# Altium schematic sheet PAGE05 FPGA Config.SchDoc
size 297 x 209 mm; SheetNumber: 5; SheetTotal: 9
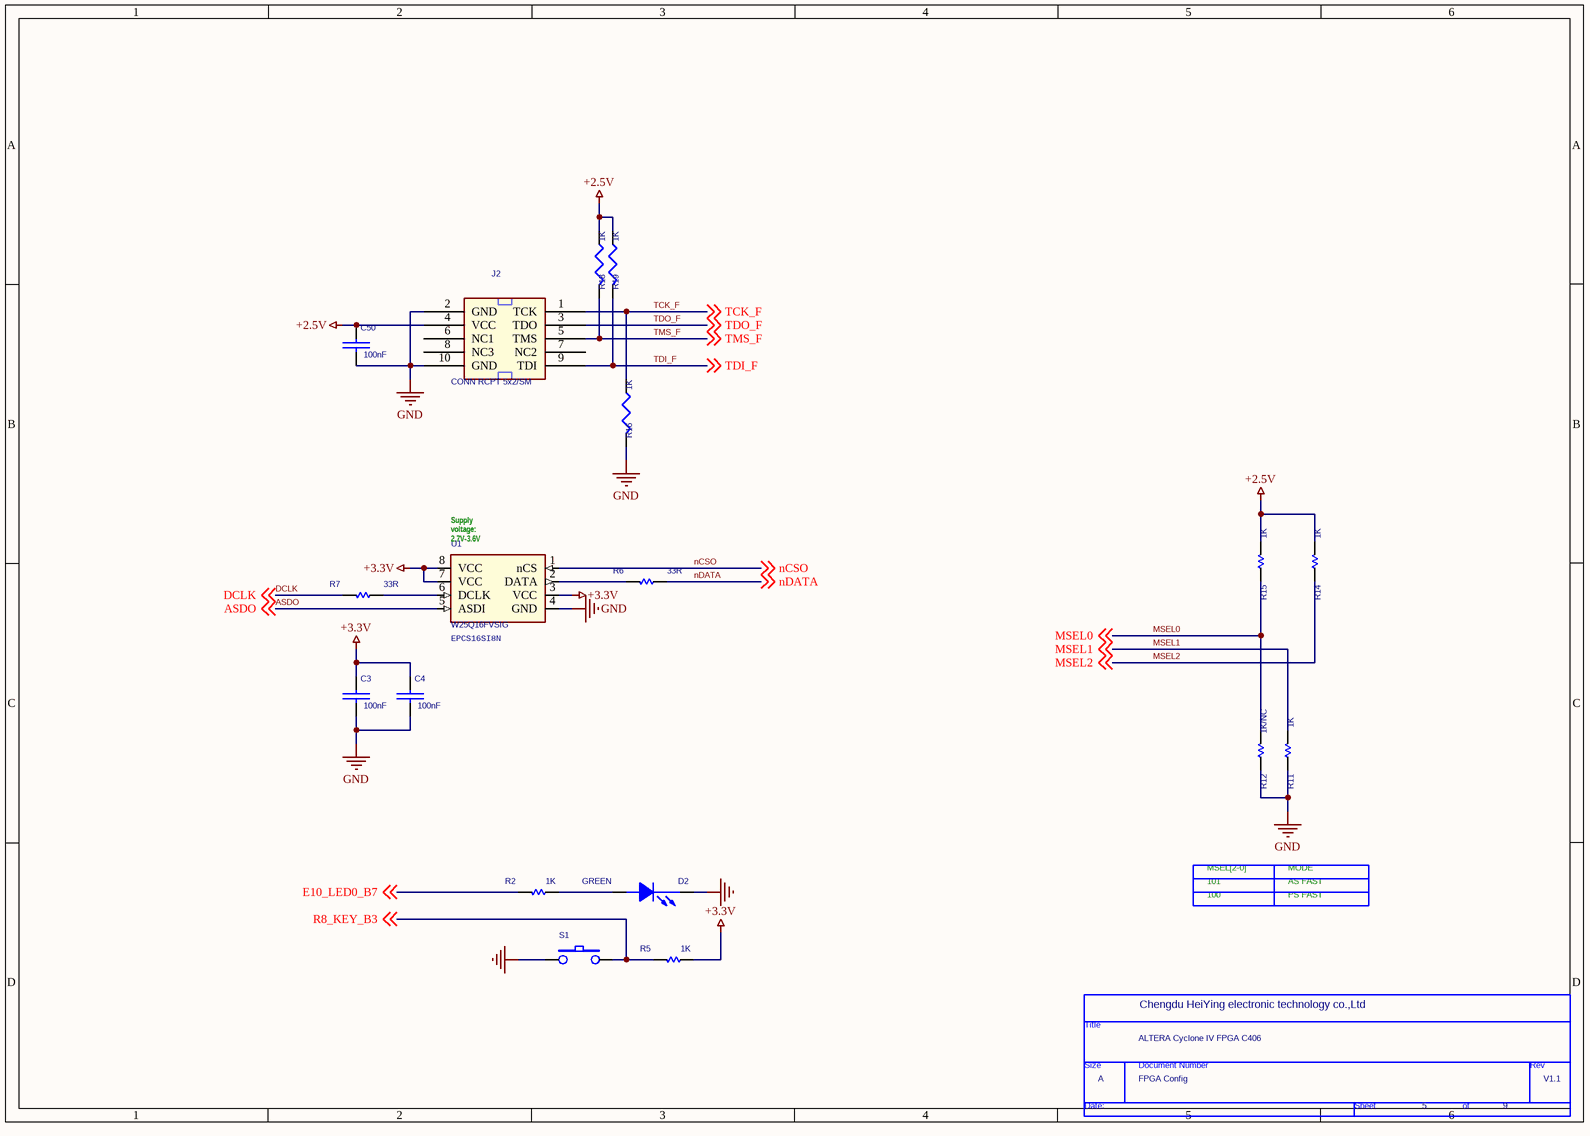
[diagram p0: PAGE05 FPGA Config.SchDoc]

## Parts
*  Page Count: 9  Page Number: 5  Page Size: A  Title: ALTERA Cyclone IV FPGA C406  RevCode: V1.1  Doc: FPGA Config  (hidden comment: TitleBlock0)  (graphical)
C3  100nF  [C0402]
C4  100nF  [C0402]
C50  100nF  [C0402]
D2  GREEN  [Q0603]
J2  CONN RCPT 5x2/SM  [DIP10-2P54-I]
R2  1K  [R0402]
R5  1K  [R0402]
R6  33R  [R0402]
R7  33R  [R0402]
R11  1K  [R0402]
R12  1K/NC  [R0402]
R14  1K  [R0402]
R15  1K  [R0402]
R16  1K  [R0402]
R18  1K  [R0402]
R19  1K  [R0402]
S1  FSMRA2JH  [SMD_3X4X2MM]  (value not drawn)
U1  W25Q16FVSIG  [SOIC8_1P27_208MIL]

## Nets
+2.5V: C50.1 J2.4(VCC) R14.2 R15.2 R18.1 R19.1
+3.3V: C3.1 C4.1 R5.1 U1.3(VCC) U1.7(VCC) U1.8(VCC)
GND: C3.2 C4.2 C50.2 D2.2(CATHODE) J2.2(GND) J2.10(GND) R11.1 R12.1 R16.2 S1.2 U1.4(GND)
ASDO: U1.5(ASDI) ; off-sheet ASDO
DCLK: R7.2 ; off-sheet DCLK
E10_LED0_B7: R2.2 ; off-sheet E10_LED0_B7
MSEL0: R12.2 R15.1 ; off-sheet MSEL0
MSEL1: R11.2 ; off-sheet MSEL1
MSEL2: R14.1 ; off-sheet MSEL2
nCSO: U1.1(nCS) ; off-sheet nCSO
nDATA: R6.1 ; off-sheet nDATA
R8_KEY_B3: R5.2 S1.1 ; off-sheet R8_KEY_B3
TCK_F: J2.1(TCK) R16.1 ; off-sheet TCK_F
TDI_F: J2.9(TDI) R19.2 ; off-sheet TDI_F
TDO_F: J2.3(TDO) ; off-sheet TDO_F
TMS_F: J2.5(TMS) R18.2 ; off-sheet TMS_F
NetD2_1: D2.1(ANODE) R2.1
NetR6_2: R6.2 U1.2(DATA)
NetR7_1: R7.1 U1.6(DCLK)

Not connected (* = marked no-connect by the designer): J2 6(NC1) 7(NC2) 8(NC3)

## Notes on the sheet
- (near U1) Supply
  voltage:
  2.7V-3.6V
- (near U1) EPCS16SI8N
- MSEL[2-0]
- MODE
- 101
- 100
- AS FAST
- PS FAST
- Chengdu HeiYing electronic technology co.,Ltd
- (in symbol TitleBlock0) Title; Size; Document Number; Rev; Date:; Sheet; of

## Library data of the parts
C3 C4 C50 = CAP_0: CAP CER .1UF 16V X7R 0402; MANUFACTURER: MURATA; MANUFACTURER P/N: GRM155R71C104KA88D; ROOM: PHY&FPGA; DISTRIBUTOR: DIGIKEY; PRICE: 0.00300; DIELECTRIC: X7R; DISTRIBUTOR P/N: 490-3261-1-ND
D2 = LED: ROOM: POWER
J2 = CONN RCPT 5x2/SM_0
R2 R5-R7 R11 R12 R14 R15 = SMALL R1
R16 R18 R19 = R_6
S1 = SWITCH_2: SWITCH TACT RA H=3.86MM 160GF; MANUFACTURER: TYCO; ROOM: CPU; MANUFACTURER P/N: FSMRA2JH
U1 = EPCS1SI8N_0
* = TitleBlock0: Page Create Date: March  8, 1995